# Altium project S7CAS-PLEIADES-CARTE-MERE-P_07.PrjPcb
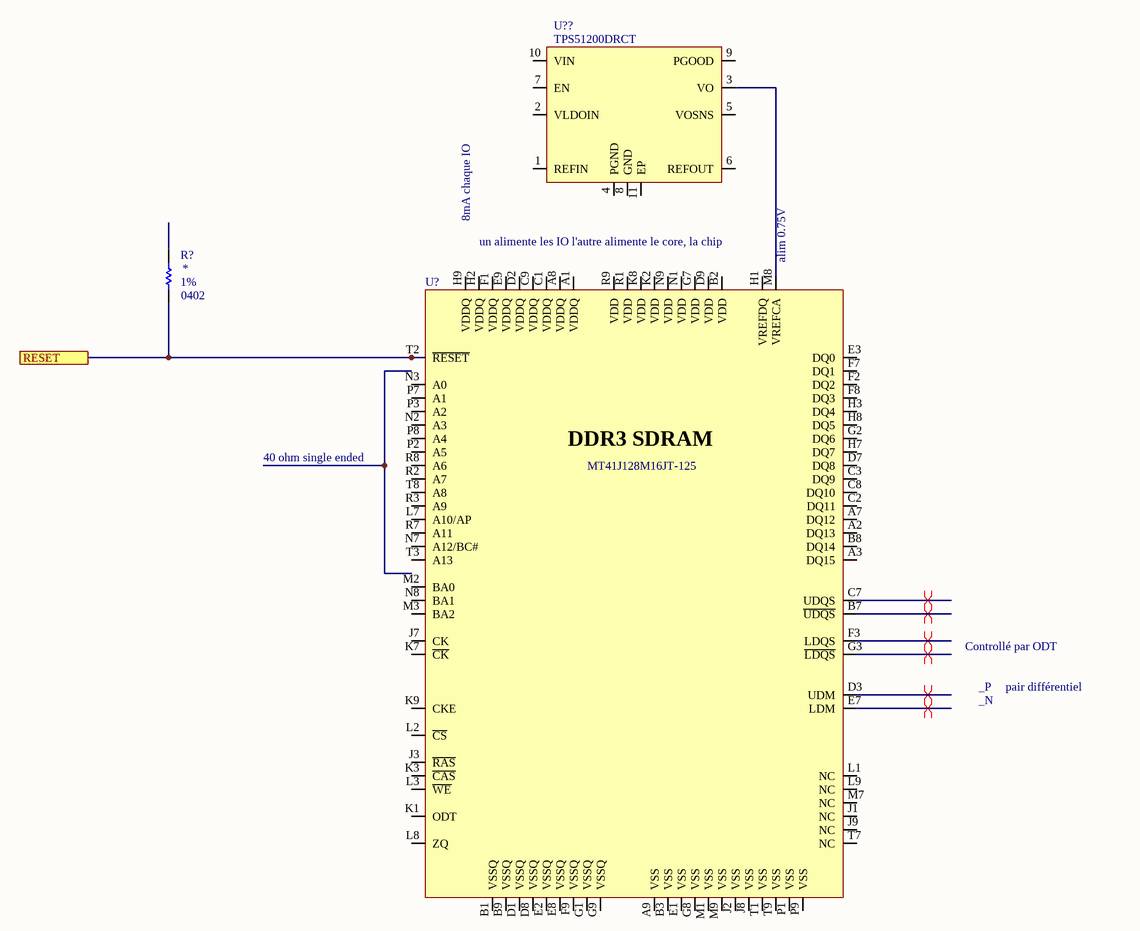
[diagram p0: DDR3.SchDoc]
1 sheet, 3 parts. Net scope: flat (ports and power ports of the same name join across sheets).

## Sheet DDR3.SchDoc
size Tabloid; SheetNumber: 1; SheetTotal: 1; Sheet_Name: PLEIADES MAIN; Size: 11x17

### Parts
R?  Package: 0402  Precision: 1%  [RES_0402]  (hidden comment: RES - 0402)
U?  MT41J128M16JT-125  [MEM_DDR3_MT41J128M16JT-125]
U??  TPS51200DRCT  [REG_PMIC_TPS51200DRCT]

### Ports
RESET

### Nets
NetR?_1: R?.1 U?.T2(~{RESET}) ; port RESET
NetU?_M8: U?.M8(VREFCA) U??.3(VO)

Not connected (* = marked no-connect by the designer): R? 2; U? A1(VDDQ) A2(DQ13) A3(DQ15) A7(DQ12) A8(VDDQ) A9(VSS) B1(VSSQ) B2(VDD) B3(VSS) B7(~{UDQS}) B8(DQ14) B9(VSSQ) C1(VDDQ) C2(DQ11) C3(DQ9) C7(UDQS) C8(DQ10) C9(VDDQ) D1(VSSQ) D2(VDDQ) D3(UDM) D7(DQ8) D8(VSSQ) D9(VDD) E1(VSS) E2(VSSQ) E3(DQ0) E7(LDM) E8(VSSQ) E9(VDDQ) F1(VDDQ) F2(DQ2) F3(LDQS) F7(DQ1) F8(DQ3) F9(VSSQ) G1(VSSQ) G2(DQ6) G3(~{LDQS}) G7(VDD) G8(VSS) G9(VSSQ) H1(VREFDQ) H2(VDDQ) H3(DQ4) H7(DQ7) H8(DQ5) H9(VDDQ) J1(NC) J2(VSS) J3(~{RAS}) J7(CK) J8(VSS) J9(NC) K1(ODT) K2(VDD) K3(~{CAS}) K7(~{CK}) K8(VDD) K9(CKE) L1(NC) L2(~{CS}) L3(~{WE}) L7(A10/AP) L8(ZQ) L9(NC) M1(VSS) M2(BA0) M3(BA2) M7(NC) M9(VSS) N1(VDD) N2(A3) N3(A0) N7(A12/BC#) N8(BA1) N9(VDD) P1(VSS) P2(A5) P3(A2) P7(A1) P8(A4) P9(VSS) R1(VDD) R2(A7) R3(A9) R7(A11) R8(A6) R9(VDD) T1(VSS) T3(A13) T7(NC) T8(A8) T9(VSS); U?? 1(REFIN) 2(VLDOIN) 4(PGND) 5(VOSNS) 6(REFOUT) 7(EN) 8(GND) 9(PGOOD) 10(VIN) 11(EP)

### Layout directives
differential pair: NetU?_B7, NetU?_C7, NetU?_D3, NetU?_E7, NetU?_F3, NetU?_G3

### Notes on the sheet
- 8mA chaque IO
- un alimente les IO l'autre alimente le core, la chip
- (near U?) alim 0.75V
- (near U?) 40 ohm single ended
- Controllé par ODT
- _P
- _N
- pair différentiel
- Sheet Name
- Project Title
- Global Project
- Size
- Group
- Revision
- Date
- Sheet
- of
- Filename
- Designers
- (in symbol MEM_DDR3_MT41J128M16JT-125:K TR) DDR3 SDRAM

### Library data of the parts
R? = RES - 0402: Voltage: 50V; Power: 1/16W; Current: *; CreatedBy: Jonathan Bouchard; Value: *
U? = MEM_DDR3_MT41J128M16JT-125:K TR: MEM - DDR3 SDRAM 2GBIT 800MHZ - TFBGA-96; Voltage: 1.425 V ~ 1.575 V; Mfg: Micrel; Current: *; Power: *; Mfg Part Number: MT41J128M16JT-125; HelpURL: http://www.micron.com/~/media/Documents/Products/Data%20Sheet/DRAM/DDR3/2Gb_DDR3_SDRAM.pdf; CreatedBy: Jonathan Bouchard; Temperature: 0°C ~ 95°C (TC); Value: *; Precision: *; Package: TFBGA-96; Supplier 1: Digikey; Supplier Part Number 1: 557-1611-1-ND
U?? = REG_PMIC_TPS51200DRCT: REG - DDR TERMINATION/REF REG - 10-VFDFN; Manufacturer #1: Texas Instruments; Value: DDR, DDR2, DDR3(L), DDR4; Voltage Rating: 2.375V ~ 3.5V; Current Rating: Source: 3A~4.5A, Sink: 3.5A~5.5A; GRAMS Lib Spec: 2.8; Magnetic Material: Unknown; Polarized: Yes; Tolerance: *; Power Max: *; HelpURL: http://www.ti.com/lit/ds/symlink/tps51200.pdf; CreatedBy/Date: Joel Lemay 2019-03-19; VerifiedBy: Nicolas V. (2019-05-31); Temperature: -40°C ~ 85°C; Package: 10-VFDFN; Manufacturer #2: *; Note: *; Assembly Type: SMD; Part Number #2: *; Part Number #1: TPS51200DRCT; Supplier 1: Digi-Key; Supplier Part Number 1: 296-23830-1-ND; Cryo: UNKNOWN